# Altium project lpedt_project_board_cubit.PrjPcb (part 1 of 4)
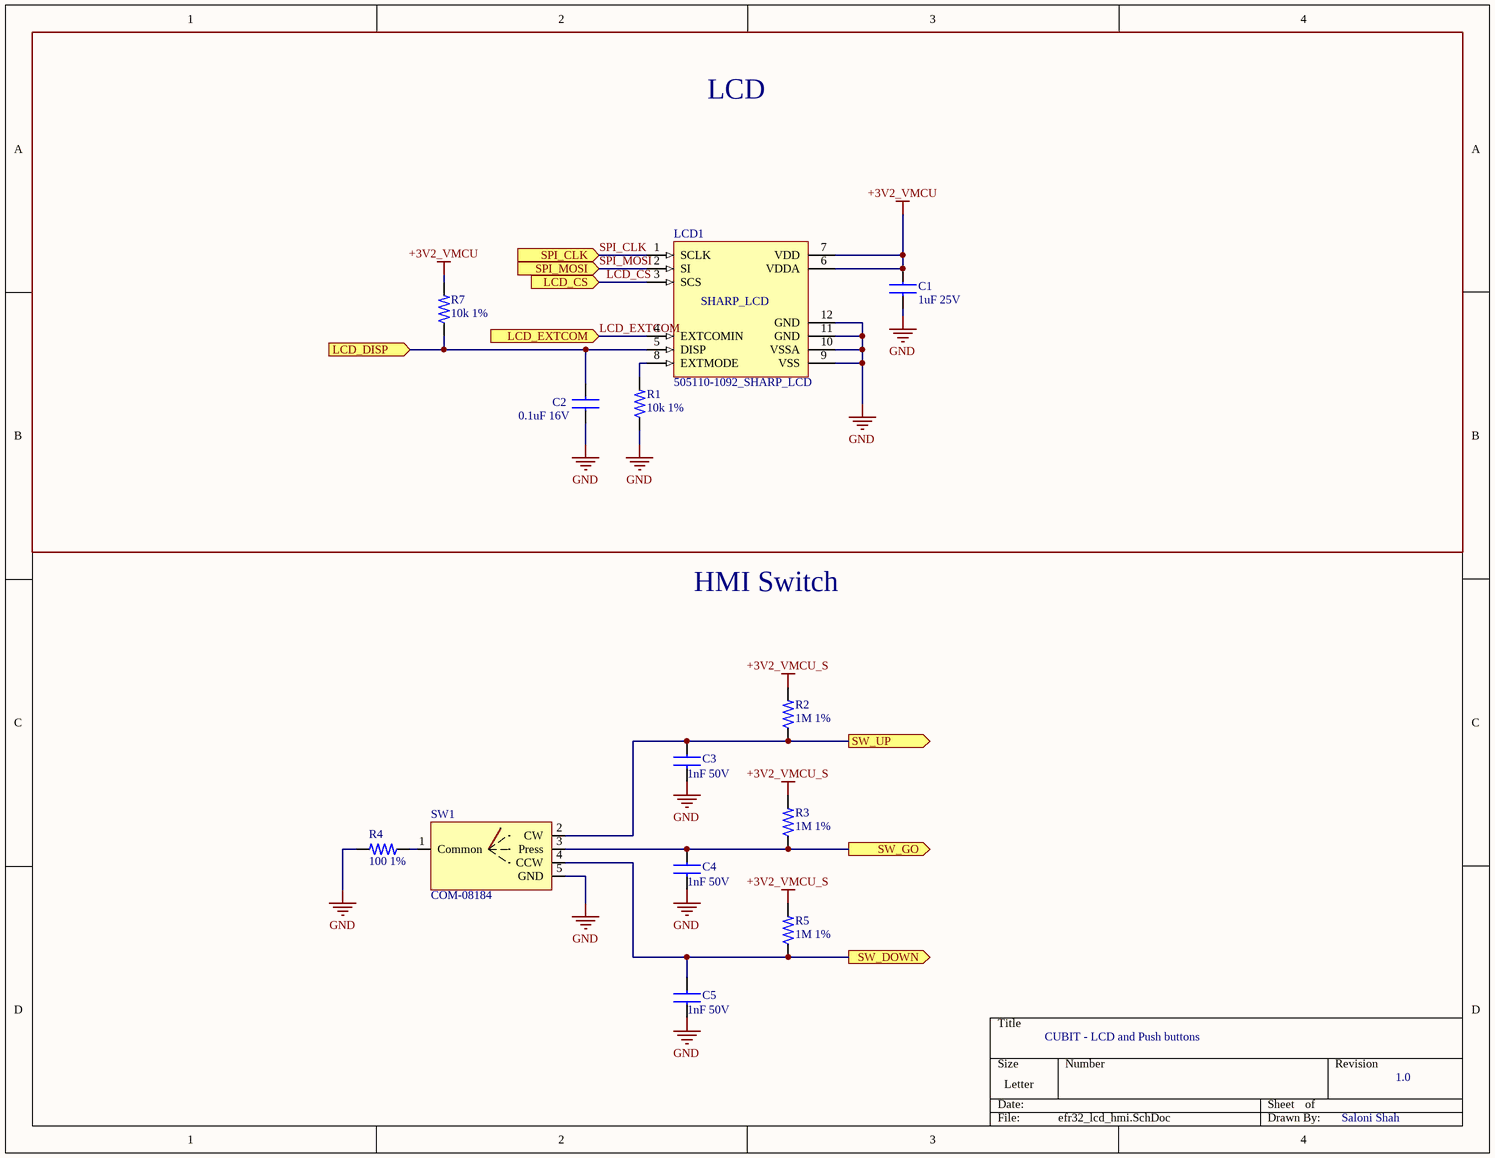
[diagram p0: efr32_lcd_hmi.SchDoc]
7 sheets, 147 parts. Net scope: flat (ports and power ports of the same name join across sheets).
Board files: Cubit3_main_pcb.PcbDoc, Cubit3_solar_panel.PcbDoc
Sheets:
  efr32_lcd_hmi.SchDoc
  efr32_ioport.SchDoc
  efr32_radio_interface.SchDoc
  power_management.SchDoc
  ultrasonic_imu_sensor.SchDoc
  Mag_Enc_Sensors_muxed.SchDoc
  solar_cell.SchDoc

## Sheet efr32_lcd_hmi.SchDoc
size Letter; SheetNumber: 2; SheetTotal: 8

### Parts
C1  1uF 25V  [CAP_0805_02X125]
C2  0.1uF 16V  [CAP_0603_1MM]
C3  1nF 50V  [CAP_0805_02X125]
C4  1nF 50V  [CAP_0805_02X125]
C5  1nF 50V  [CAP_0805_02X125]
LCD1  505110-1092_SHARP_LCD  [SHARP_LCD]
R1  10k 1%  [2_Chip_0603_RMCF]
R2  1M 1%  [2_Chip_0603_RMCF]
R3  1M 1%  [2_Chip_0603_RMCF]
R4  100 1%  [2_Chip_0603_RMCF]
R5  1M 1%  [2_Chip_0603_RMCF]
R7  10k 1%  [2_Chip_0603_RMCF]
SW1  COM-08184  [Navigation_switch]

### Blocks framed on the sheet
LCD: C1 C2 LCD1 R1 R7

### Ports
LCD_CS (in), LCD_DISP (in), LCD_EXTCOM (in), SPI_CLK (in), SPI_MOSI (in), SW_DOWN (out), SW_GO (out), SW_UP (out)

### Nets
+3V2_VMCU: C1.1 LCD1.6(VDDA) LCD1.7(VDD) R7.2
+3V2_VMCU_S: R2.2 R3.2 R5.2
GND: C1.2 C2.2 C3.2 C4.2 C5.2 LCD1.9(VSS) LCD1.10(VSSA) LCD1.11(GND) LCD1.12(GND) R1.1 R4.2 SW1.5(GND)
LCD_CS: LCD1.3(SCS) ; port LCD_CS
LCD_DISP: C2.1 LCD1.5(DISP) R7.1 ; port LCD_DISP
LCD_EXTCOM: LCD1.4(EXTCOMIN) ; port LCD_EXTCOM
SPI_CLK: LCD1.1(SCLK) ; port SPI_CLK
SPI_MOSI: LCD1.2(SI) ; port SPI_MOSI
SW_DOWN: C5.1 R5.1 SW1.4(CCW) ; port SW_DOWN
SW_GO: C4.1 R3.1 SW1.3(Press) ; port SW_GO
SW_UP: C3.1 R2.1 SW1.2(CW) ; port SW_UP
NetLCD1_8: LCD1.8(EXTMODE) R1.2
NetR4_1: R4.1 SW1.1(Common)

### Notes on the sheet
- HMI Switch
- CUBIT - LCD and Push buttons
- 1.0
- Saloni Shah
- (in symbol 505110-1092_SHARP_LCD) SHARP_LCD

### Library data of the parts
C1 = GRM216R61E105KA12D: Cap 1 µF ±10% 25V Ceramic Capacitor X5R 0805 (2012 Metric); Manufacturer: Murata; Supplier 1: Digi-Key; Manufacturer Part Number: GRM216R61E105KA12D; RoHS: Yes; Category: Ceramic Capacitors; Stock 1: 738438; Pricing 1: 4000=0.09051, 8000=0.08518, 12000=0.08252, 28000=0.07986, 100000=0.06921 (USD); Mount: Surface Mount; Case/Package: 0805; Number of Pins: 2; Case Code (Imperial): 0805; Case Code (Metric): 2012; Material: Ceramic; Min Operating Temperature: -55°C; Max Operating Temperature: 85°C; Package Quantity: 1; Series: GRM; Packaging: Tape and Reel; Capacitance: 1uF; Voltage Rating: 25V; Voltage Rating (DC): 25V; Tolerance: 10%; Dielectric: X5R; Termination: SMD/SMT; Voltage: 25V; Construction: Flat; Length: 2mm; Width: 1.25mm; Height: 0.6mm; Thickness: 0.028inch; Depth: 1.25mm; Radiation Hardening: No; Lead Free: Lead Free; REACH SVHC: No SVHC; RoHS Compliant: Yes; ComponentLink1URL: https://datasheet.ciiva.com/11787/0900766b80ef921d-11787891.pdf?src-supplier=RSComponents; ComponentLink1Description: https://datasheet.ciiva.com/11787/0900766b80ef921d-11787891.pdf?src-supplier=RSComponents; ComponentLink2URL: https://datasheet.ciiva.com/5424/product-5424880.pdf?src-supplier=Mouser; ComponentLink2Description: https://datasheet.ciiva.com/5424/product-5424880.pdf?src-supplier=Mouser; ComponentLink3URL: https://datasheet.ciiva.com/3777/337grm216r61e105ka1223-3777289.pdf?src-supplier=Arrow+Electronics; ComponentLink3Description: https://datasheet.ciiva.com/3777/337grm216r61e105ka1223-3777289.pdf?src-supplier=Arrow+Electronics; ComponentLink4URL: https://datasheet.ciiva.com/7719/c02e-7719049.pdf?src-supplier=Element14; ComponentLink4Description: https://datasheet.ciiva.com/7719/c02e-7719049.pdf?src-supplier=Element14; ComponentLink5URL: https://datasheet.ciiva.com/22706/1889704-22706791.pdf?src-supplier=Element14; ComponentLink5Description: https://datasheet.ciiva.com/22706/1889704-22706791.pdf?src-supplier=Element14; ComponentLink6URL: https://datasheet.ciiva.com/138/partnumbering-e-01-138518.pdf?src-supplier=Digi-Key; ComponentLink6Description: https://datasheet.ciiva.com/138/partnumbering-e-01-138518.pdf?src-supplier=Digi-Key; ComponentLink7URL: https://datasheet.ciiva.com/138/partnumbering-e-01-138517.pdf?src-supplier=Digi-Key; ComponentLink7Description: https://datasheet.ciiva.com/138/partnumbering-e-01-138517.pdf?src-supplier=Digi-Key; ComponentLink8URL: https://datasheet.ciiva.com/138/partnumbering-e-01-138519.pdf?src-supplier=Digi-Key; ComponentLink8Description: https://datasheet.ciiva.com/138/partnumbering-e-01-138519.pdf?src-supplier=Digi-Key; ComponentLink9URL: https://datasheet.ciiva.com/2989/product-2989638.pdf?src-supplier=Avnet; ComponentLink9Description: https://datasheet.ciiva.com/2989/product-2989638.pdf?src-supplier=Avnet
C2 = C0805C104K4RACAUTO: Cap Ceramic 0.1uF 16V X7R 10% SMD 0603 125°C Paper T/R; Manufacturer: KEMET; Capacitance: 100nF; Supplier 1: Digi-Key; Manufacturer Part Number: C0805C104K4RACAUTO; RoHS: Yes; Category: Ceramic Capacitors; Stock 1: 15900; Pricing 1: 1=0.24000, 10=0.16200, 50=0.09700, 100=0.08190, 500=0.05606, 1000=0.04959 (USD); Case/Package: 0805; Min Operating Temperature: -55°C; Max Operating Temperature: 125°C; Tolerance: 10%; Packaging: Tape and Reel; Dielectric: X7R; Length: 2mm; Depth: 1.25mm; RoHS Compliant: Yes; ComponentLink1URL: http://components.arrow.com/part/dataview/0323_00325188?src-supplier=Arrow+Europe; ComponentLink1Description: http://components.arrow.com/part/dataview/0323_00325188?src-supplier=Arrow+Europe
C3-C5 = CL21B102KBANFNC: 1nF ±10% 50V X7R 0805; Manufacturer: Samsung; Supplier 1: Digi-Key; Manufacturer Part Number: CL21B102KBANFNC; RoHS: Yes; Category: Ceramic Capacitors; Stock 1: 1056; Pricing 1: 1=0.10000, 10=0.04300, 50=0.02360, 100=0.01940, 500=0.01382, 1000=0.01086 (USD); Mount: Surface Mount; Case/Package: 0805; Case Code (Metric): 2012; Case Code (Imperial): 0805; Contact Plating: Tin; Min Operating Temperature: -55°C; Max Operating Temperature: 125°C; Capacitance: 1nF; Tolerance: 10%; Package Quantity: 1; Packaging: Tape and Reel; Voltage Rating: 50V; Dielectric: X7R; Series: CL; Construction: Flat; Length: 0.079inch; Width: 0.049inch; Height: 0.65mm; Thickness: 0.03inch; Depth: 1.25mm; Radiation Hardening: No; RoHS Compliant: Yes; ComponentLink1URL: https://datasheet.ciiva.com/25780/cl21b102kbanfnc-25780808.pdf?src-supplier=Digi-Key; ComponentLink1Description: https://datasheet.ciiva.com/25780/cl21b102kbanfnc-25780808.pdf?src-supplier=Digi-Key
LCD1 = 505110-1092_SHARP_LCD: FFC/FPC Connector, 10 Contact(s), 1 Row(s), Female, Right Angle, Surface Mount Terminal; Manufacturer: Molex; Connector Type: CARD EDGE CONNECTOR; Option: General Purpose; Filter Feature: No; Number of Rows Loaded: 1; Number of Contacts: 10; Supplier 1: Digi-Key; Manufacturer Part Number: 505110-1092; RoHS: Yes; Category: FFC / FPC; Stock 1: 86494; Pricing 1: 1=0.77, 10=0.653, 100=0.5078, 1000=0.39896 (USD); Mount: Board; Contact Material: Bronze; Contact Finish - Mating: GOLD OVER NICKEL; Contact Finish - Termination: GOLD OVER NICKEL; JESD-609 Code: e4; Contact Gender: Female; Mating Information: NO; Mixed Contacts: No; Mounting Style: RIGHT ANGLE; Termination: SMD/SMT; Terminal Pitch: 0.5mm; Flammability Rating: UL94 V-0; DIN Conformance: No; IEC Conformance: No; MIL Conformance: No; Reach SVHC Compliant: Yes; RoHS Compliant: Yes; ComponentLink1URL: https://datasheet.ciiva.com:443/pdfs/VipMasterIC/IC/MOLE/MOLE-S-A0009009131/MOLE-S-A0009009131-1.pdf?src-supplier=IHS+Markit; ComponentLink1Description: https://datasheet.ciiva.com:443/pdfs/VipMasterIC/IC/MOLE/MOLE-S-A0009009131/MOLE-S-A0009009131-1.pdf?src-supplier=IHS+Markit; ComponentLink2URL: https://media.digikey.com/pdf/Data%20Sheets/Molex%20PDFs/FFC-FPC_Connectors.pdf?src-supplier=Digi-Key; ComponentLink2Description: https://media.digikey.com/pdf/Data%20Sheets/Molex%20PDFs/FFC-FPC_Connectors.pdf?src-supplier=Digi-Key; ComponentLink3URL: http://www.farnell.com/datasheets/2215713.pdf?src-supplier=Farnell; ComponentLink3Description: http://www.farnell.com/datasheets/2215713.pdf?src-supplier=Farnell; ComponentLink4URL: https://www.mouser.com/ds/2/276/5051101092_FFC_FPC_CONNECTORS-772849.pdf?src-supplier=Mouser; ComponentLink4Description: https://www.mouser.com/ds/2/276/5051101092_FFC_FPC_CONNECTORS-772849.pdf?src-supplier=Mouser; ComponentLink5URL: http://www.alliedelec.com/m/d/498d8ef60ec1840486550b3bb04c7a47.pdf?src-supplier=Allied+Electronics; ComponentLink5Description: http://www.alliedelec.com/m/d/498d8ef60ec1840486550b3bb04c7a47.pdf?src-supplier=Allied+Electronics; ComponentLink6URL: https://www.molex.com/datasheets/rohspdf/5051101092_rohs.pdf?src-supplier=Digi-Key; ComponentLink6Description: https://www.molex.com/datasheets/rohspdf/5051101092_rohs.pdf?src-supplier=Digi-Key; ComponentLink7URL: http://www.farnell.com/datasheets/2215713.pdf?src-supplier=Newark; ComponentLink7Description: http://www.farnell.com/datasheets/2215713.pdf?src-supplier=Newark; ComponentLink8URL: http://www.farnell.com/datasheets/2014276.pdf?src-supplier=Element14; ComponentLink8Description: http://www.farnell.com/datasheets/2014276.pdf?src-supplier=Element14; ComponentLink9URL: http://www.farnell.com/datasheets/2215713.pdf?src-supplier=Element14; ComponentLink9Description: http://www.farnell.com/datasheets/2215713.pdf?src-supplier=Element14
R1 R7 = RMCF0603FT10K0: Res 10K Ohm 1% 1/10W ±100ppm/°C Molded SMD SMD Paper T/R; Manufacturer: Stackpole Electronics; Resistance: 10kR; Power Rating: 100mW; Supplier 1: Digi-Key; Manufacturer Part Number: RMCF0603FT10K0; RoHS: Yes; Category: Chip SMD Resistors; Stock 1: 15114443; Pricing 1: 5000=0.00218 (USD); Mount: Surface Mount; Case/Package: 0603; Case Code (Metric): 1608; Case Code (Imperial): 0603; Contact Plating: Tin,Matte; Size Code: 0603; Min Operating Temperature: -55°C; Max Operating Temperature: 155°C; Tolerance: 1%; Packaging: Tape and Reel; Resistor Type: Thick Film; Number of Terminations: 2; Max Power Dissipation: 100mW; Temperature Coefficient: 100ppm/°C; Features: Automotive AEC-Q200; Series: RMCF; Construction: Rectangular; Length: 1.55mm; Width: 0.031inch; Height: 0.022inch; Depth: 0.8mm; Radiation Hardening: No; Military Standard: Not; Lead Free: Lead Free; RoHS Compliant: Yes; ComponentLink1URL: http://components.arrow.com/part/dataview/43747082S6756917N1174?src-supplier=Arrow+Electronics; ComponentLink1Description: http://components.arrow.com/part/dataview/43747082S6756917N1174?src-supplier=Arrow+Electronics; ComponentLink2URL: https://www.seielect.com/catalog/SEI-RMCF_RMCP.pdf?src-supplier=Avnet; ComponentLink2Description: https://www.seielect.com/catalog/SEI-RMCF_RMCP.pdf?src-supplier=Avnet; ComponentLink3URL: http://www.seielect.com/catalog/sei-rmc.pdf?src-supplier=Future+Electronics; ComponentLink3Description: http://www.seielect.com/catalog/sei-rmc.pdf?src-supplier=Future+Electronics; ComponentLink4URL: https://www.verical.com/server-webapp/html/getDatasheet?partID=360913&src-supplier=Verical; ComponentLink4Description: https://www.verical.com/server-webapp/html/getDatasheet?partID=360913&src-supplier=Verical; ComponentLink5URL: https://www.seielect.com/catalog/sei-rmcf_rmcp.pdf?src-supplier=Digi-Key; ComponentLink5Description: https://www.seielect.com/catalog/sei-rmcf_rmcp.pdf?src-supplier=Digi-Key
R2 R3 R5 = RMCF0603FT1M00: Res 1M Ohm 1% 1/10W ±100ppm/°C Molded SMD Paper T/R; Manufacturer: Stackpole Electronics; Resistance: 1MR; Power Rating: 100mW; Working Voltage: 75V; Supplier 1: Digi-Key; Manufacturer Part Number: RMCF0603FT1M00; RoHS: Yes; Category: Chip SMD Resistors; Stock 1: 2136203; Pricing 1: 1=0.10000, 10=0.01700, 100=0.00680, 1000=0.00305, 2500=0.00264 (USD); Mount: Surface Mount; Case/Package: 0603; Case Code (Metric): 1608; Case Code (Imperial): 0603; Contact Plating: Tin,Matte; Min Operating Temperature: -55°C; Max Operating Temperature: 155°C; Tolerance: 1%; Packaging: Tape and Reel; Resistor Type: Thick Film; Number of Terminations: 2; Max Power Dissipation: 100mW; Temperature Coefficient: 100ppm/°C; Features: Automotive AEC-Q200; Series: RMCF; Construction: Rectangular; Technology: THICK FILM; Length: 1.55mm; Width: 0.031inch; Height: 0.022inch; Depth: 0.8mm; Radiation Hardening: No; Military Standard: Not; Lead Free: Lead Free; RoHS Compliant: Yes; ComponentLink1URL: https://datasheet.ciiva.com/15193/getdatasheetpartid-363151-15193451.pdf?src-supplier=Verical; ComponentLink1Description: https://datasheet.ciiva.com/15193/getdatasheetpartid-363151-15193451.pdf?src-supplier=Verical
R4 = RMCF0603FT100R: Res 100 Ohm 1% 1/10W ±100ppm/°C Molded SMD SMD Paper T/R; Manufacturer: Stackpole Electronics; Resistance: 100R; Power Rating: 100mW; Supplier 1: Digi-Key; Manufacturer Part Number: RMCF0603FT100R; RoHS: Yes; Category: Chip SMD Resistors; Pricing 1: 1=0.10000, 10=0.01700, 100=0.00680, 1000=0.00305, 2500=0.00264 (USD); Mount: Surface Mount; Case/Package: 0603; Case Code (Metric): 1608; Case Code (Imperial): 0603; Contact Plating: Tin,Matte; Size Code: 0603; Min Operating Temperature: -55°C; Max Operating Temperature: 155°C; Tolerance: 1%; Packaging: Tape and Reel; Resistor Type: Thick Film; Number of Terminations: 2; Max Power Dissipation: 100mW; Temperature Coefficient: 100ppm/°C; Features: Automotive AEC-Q200; Series: RMCF; Construction: Rectangular; Length: 1.55mm; Width: 0.031inch; Height: 0.022inch; Depth: 0.8mm; Radiation Hardening: No; Military Standard: Not; Lead Free: Lead Free; RoHS Compliant: Yes; ComponentLink1URL: https://datasheet.ciiva.com/15215/getdatasheetpartid-360413-15215981.pdf?src-supplier=Verical; ComponentLink1Description: https://datasheet.ciiva.com/15215/getdatasheetpartid-360413-15215981.pdf?src-supplier=Verical
SW1 = COM-08184: Surface Mount Navigation Switch; Manufacturer: SparkFun; Supplier 1: Digikey; Manufacturer Part Number: COM-08184; RoHS: No; Stock 1: 109; Pricing 1: 1=1.6 (USD); ComponentLink1URL: https://cdn.sparkfun.com/datasheets/Components/Switches/LEVER8184.pdf?src-supplier=Digikey; ComponentLink1Description: https://cdn.sparkfun.com/datasheets/Components/Switches/LEVER8184.pdf?src-supplier=Digikey

## Sheet efr32_ioport.SchDoc
size A; SheetNumber: 3; SheetTotal: 8
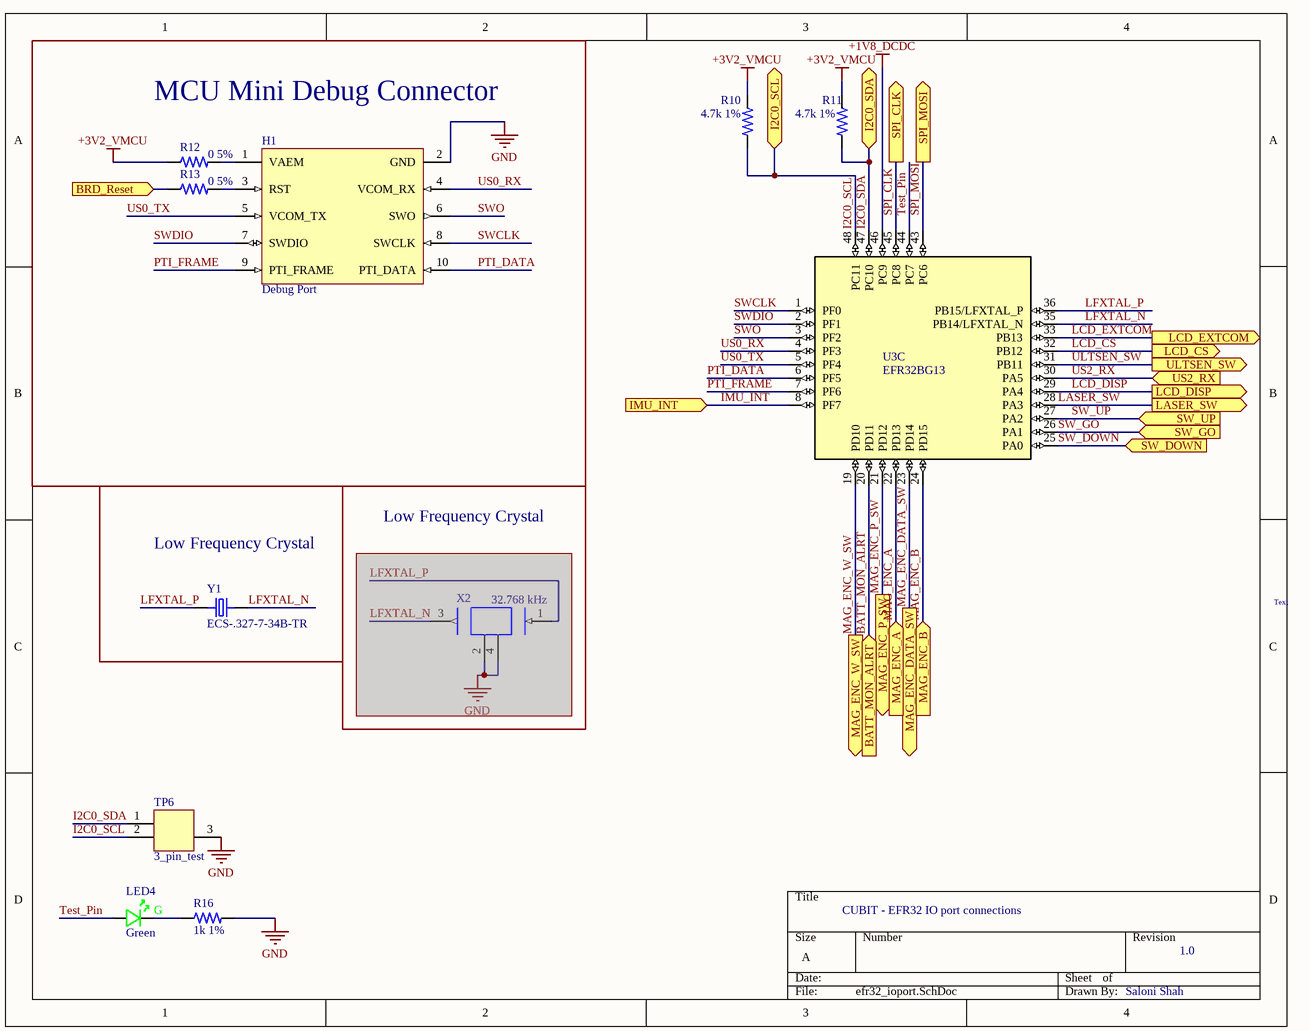
[diagram p1: efr32_ioport.SchDoc]

### Parts
H1  Debug Port  [Amphenol_20021121_0]
LED4  Green  [LED_0603_RED_WL-SMCW]
R10  4.7k 1%  [CAP_0603_1MM]
R11  4.7k 1%  [CAP_0603_1MM]
R12  0 5%  [CAP_0402_1mm]
R13  0 5%  [CAP_0402_1mm]
R16  1k 1%  [2_Chip_0603_RMCF]
TP6  3_pin_test  [3_PIN_100mil]
U3  EFR32BG13  [48-QFN_7x7]  (part C of 3)
X2  32.768 kHz  [OSC_ASDDV-48.000MHZ-LC-T]  (masked out: inside a compile mask, not in the netlist)
Y1  ECS-.327-7-34B-TR  [XTAL_ECS-.327-7-34B-TR]

### Blocks framed on the sheet
MCU Mini Debug Connector: H1 R12 R13
Low Frequency Crystal: Y1
Low Frequency Crystal: X2

### Ports
BATT_MON_ALRT (in), BRD_Reset (in), I2C0_SCL (bidir), I2C0_SDA (bidir), IMU_INT (in), LASER_SW (out), LCD_CS (out), LCD_DISP (out), LCD_EXTCOM (out), MAG_ENC_A (in), MAG_ENC_B (in), MAG_ENC_DATA_SW (out), MAG_ENC_P_SW (out), MAG_ENC_W_SW (out), SPI_CLK (out), SPI_MOSI (out), SW_DOWN (in), SW_GO (in), SW_UP (in), ULTSEN_SW (out), US2_RX (in)

### Nets
+1V8_DCDC: U3.46(PC9)
+3V2_VMCU: R10.1 R11.1 R12.1
GND: H1.2(GND) R16.2 TP6.3
BATT_MON_ALRT: U3.20(PD11) ; port BATT_MON_ALRT
BRD_Reset: R13.1 ; port BRD_Reset
I2C0_SCL: R10.2 TP6.2 U3.48(PC11) ; port I2C0_SCL
I2C0_SDA: R11.2 TP6.1 U3.47(PC10) ; port I2C0_SDA
IMU_INT: U3.8(PF7) ; port IMU_INT
LASER_SW: U3.28(PA3) ; port LASER_SW
LCD_CS: U3.32(PB12) ; port LCD_CS
LCD_DISP: U3.29(PA4) ; port LCD_DISP
LCD_EXTCOM: U3.33(PB13) ; port LCD_EXTCOM
LFXTAL_N: U3.35(PB14/LFXTAL_N) Y1.2
LFXTAL_P: U3.36(PB15/LFXTAL_P) Y1.1
MAG_ENC_A: U3.22(PD13) ; port MAG_ENC_A
MAG_ENC_B: U3.24(PD15) ; port MAG_ENC_B
MAG_ENC_DATA_SW: U3.23(PD14) ; port MAG_ENC_DATA_SW
MAG_ENC_P_SW: U3.21(PD12) ; port MAG_ENC_P_SW
MAG_ENC_W_SW: U3.19(PD10) ; port MAG_ENC_W_SW
PTI_DATA: H1.10(PTI_DATA) U3.6(PF5)
PTI_FRAME: H1.9(PTI_FRAME) U3.7(PF6)
SPI_CLK: U3.45(PC8) ; port SPI_CLK
SPI_MOSI: U3.43(PC6) ; port SPI_MOSI
SW_DOWN: U3.25(PA0) ; port SW_DOWN
SW_GO: U3.26(PA1) ; port SW_GO
SW_UP: U3.27(PA2) ; port SW_UP
SWCLK: H1.8(SWCLK) U3.1(PF0)
SWDIO: H1.7(SWDIO) U3.2(PF1)
SWO: H1.6(SWO) U3.3(PF2)
Test_Pin: LED4.A U3.44(PC7)
ULTSEN_SW: U3.31(PB11) ; port ULTSEN_SW
US0_RX: H1.4(VCOM_RX) U3.4(PF3)
US0_TX: H1.5(VCOM_TX) U3.5(PF4)
US2_RX: U3.30(PA5) ; port US2_RX
NetH1_1: H1.1(VAEM) R12.2
NetH1_3: H1.3(RST) R13.2
NetLED4_C: LED4.C R16.1

### Notes on the sheet
- Text
- CUBIT - EFR32 IO port connections
- 1.0
- Saloni Shah
- (in symbol QBLP601-AG1) G

### Library data of the parts
H1 = 20021121-00010C1LF: CONN HEADER SMD 10POS 1.27MM. Connector Header Surface Mount 10 position 0.050"; Manufacturer: Amphenol ICC / FCI; Supplier 1: Digi-Key; Manufacturer Part Number: 20021121-00010C1LF; RoHS: No; Category: Headers and Wire Housings
LED4 = QBLP601-AG1: Led Green Clear 0603 SMD; Manufacturer: QT-Brightek; Supplier 1: Digi-Key; Manufacturer Part Number: QBLP601-AG1; RoHS: No; Stock 1: 5990; Pricing 1: 1=0.35000, 10=0.19000, 100=0.08820, 500=0.08140, 1000=0.06377, 2000=0.06242 (USD)
R10 R11 = AF0603FR-074K7L: Res Thick Film 0603 4.7K Ohm 1% 1/10W ±100ppm/°C Molded SMD Paper T/R; Manufacturer: Yageo; Resistance: 4.7kR; Power Rating: 100mW; Voltage Rating: 75V; Supplier 1: Digi-Key; Manufacturer Part Number: AF0603FR-074K7L; RoHS: Yes; Category: Chip SMD Resistors; Stock 1: 6660; Pricing 1: 1=0.10000, 10=0.06100, 100=0.02470, 1000=0.01109, 2500=0.00963 (USD); Case/Package: 0603; Case Code (Imperial): 0603; Case Code (Metric): 1608; Weight: 7.1E-05oz; Min Operating Temperature: -55°C; Max Operating Temperature: 155°C; Tolerance: 1%; Packaging: Tape and Reel; Resistor Type: Thick Film; Number of Terminations: 2; Package Quantity: 5000; Termination: SMD/SMT; Max Power Dissipation: 100mW; Temperature Coefficient: 100ppm/°C; Features: Moisture Resistant,Anti-Sulfur; Length: 0.063inch; Width: 0.031inch; Height: 0.022inch; RoHS Compliant: Yes; ComponentLink1URL: http://www.mouser.com/ds/2/447/PYu-AF_51_RoHS_L_5-1085711.pdf?src-supplier=Mouser; ComponentLink1Description: http://www.mouser.com/ds/2/447/PYu-AF_51_RoHS_L_5-1085711.pdf?src-supplier=Mouser; ComponentLink2URL: http://www.yageo.com/documents/recent/PYu-AF_51_RoHS_L_5.pdf?src-supplier=Digi-Key; ComponentLink2Description: http://www.yageo.com/documents/recent/PYu-AF_51_RoHS_L_5.pdf?src-supplier=Digi-Key
R12 R13 = RC1005J000CS: Res 0 Ohms ±5% 0.063 W 0402 Thick Film Surface Mount Chip Resistor; Manufacturer: Samsung; Resistance: 0R; Power Rating: 63mW; Temperature Coefficient: 200ppm/°C; Voltage Rating (DC): 50V; Supplier 1: Digi-Key; Manufacturer Part Number: RC1005J000CS; RoHS: Yes; Category: Chip SMD Resistors; Stock 1: 580; Pricing 1: 1=0.10000, 10=0.04200, 25=0.03040, 50=0.02300, 100=0.01700, 250=0.01296, 500=0.01036, 1000=0.00763, 5000=0.00547 (USD); Mount: Surface Mount; Case/Package: 0402; Case Code (Metric): 1005; Case Code (Imperial): 0402; Contact Plating: Tin; Size Code: 0402; Min Operating Temperature: -55°C; Max Operating Temperature: 125°C; Packaging: Tape and Reel; Tolerance: 5%; Resistor Type: Thick Film; Number of Terminations: 2; Max Power Dissipation: 63mW; Features: Moisture Resistant; Series: RC; Construction: Rectangular; Length: 1mm; Width: 0.02inch; Height: 0.016inch; Depth: 0.5mm; Radiation Hardening: No; Military Standard: Not; Lead Free: Lead Free; RoHS Compliant: Yes; ComponentLink1URL: https://datasheet.ciiva.com/15196/getdatasheetpartid-499011-15196236.pdf?src-supplier=Verical; ComponentLink1Description: https://datasheet.ciiva.com/15196/getdatasheetpartid-499011-15196236.pdf?src-supplier=Verical; ComponentLink2URL: https://datasheet.ciiva.com/16449/rcseries-16449310.pdf?src-supplier=Future+Electronics; ComponentLink2Description: https://datasheet.ciiva.com/16449/rcseries-16449310.pdf?src-supplier=Future+Electronics
R16 = RMCF0603FT1K00: Res 1K Ohm 1% 0.1W(1/10W) ±100ppm/C Pad SMD Automotive T/R; Manufacturer: Stackpole Electronics; Resistance: 1kR; Power Rating: 100mW; Temperature Coefficient: 100ppm/°C; Supplier 1: Digi-Key; Manufacturer Part Number: RMCF0603FT1K00; RoHS: Yes; Category: Chip SMD Resistors; Pricing 1: 1=0.10000, 10=0.01700, 100=0.00680, 1000=0.00305, 2500=0.00264 (USD); Mount: Surface Mount; Case/Package: 0603; Case Code (Metric): 1608; Case Code (Imperial): 0603; Contact Plating: Tin,Matte; Size Code: 0603; Min Operating Temperature: -55°C; Max Operating Temperature: 155°C; Tolerance: 1%; Packaging: Tape and Reel; Resistor Type: Thick Film; Number of Terminations: 2; Max Power Dissipation: 100mW; Features: Automotive AEC-Q200; Series: RMCF; Construction: Rectangular; Length: 1.55mm; Width: 0.031inch; Height: 0.022inch; Depth: 0.8mm; Radiation Hardening: No; Military Standard: Not; Lead Free: Lead Free; RoHS Compliant: Yes; ComponentLink1URL: https://www.seielect.com/catalog/sei-rmcf_rmcp.pdf?src-supplier=Digi-Key; ComponentLink1Description: https://www.seielect.com/catalog/sei-rmcf_rmcp.pdf?src-supplier=Digi-Key; ComponentLink2URL: https://www.seielect.com/catalog/SEI-RMCF_RMCP.pdf?src-supplier=Avnet; ComponentLink2Description: https://www.seielect.com/catalog/SEI-RMCF_RMCP.pdf?src-supplier=Avnet; ComponentLink3URL: https://www.seielect.com/catalog/SEI-Packaging.pdf?src-supplier=Avnet; ComponentLink3Description: https://www.seielect.com/catalog/SEI-Packaging.pdf?src-supplier=Avnet; ComponentLink4URL: https://www.seielect.com/catalog/SEI-Packaging.pdf?src-supplier=Arrow+Electronics; ComponentLink4Description: https://www.seielect.com/catalog/SEI-Packaging.pdf?src-supplier=Arrow+Electronics; ComponentLink5URL: https://www.seielect.com/catalog/SEI-RMCF_RMCP.pdf?src-supplier=Avnet+Asia; ComponentLink5Description: https://www.seielect.com/catalog/SEI-RMCF_RMCP.pdf?src-supplier=Avnet+Asia; ComponentLink6URL: http://www.seielect.com/Catalog/SEI-rmc.pdf?src-supplier=Future+Electronics; ComponentLink6Description: http://www.seielect.com/Catalog/SEI-rmc.pdf?src-supplier=Future+Electronics; ComponentLink7URL: https://www.seielect.com/catalog/SEI-Packaging.pdf?src-supplier=Verical; ComponentLink7Description: https://www.seielect.com/catalog/SEI-Packaging.pdf?src-supplier=Verical; ComponentLink8URL: https://www.seielect.com/catalog/SEI-Packaging.pdf?src-supplier=Quest; ComponentLink8Description: https://www.seielect.com/catalog/SEI-Packaging.pdf?src-supplier=Quest
U3 = EFR32BG13P732F512GM48-D: Blue Gecko QFN48 2.4 G 19 dB BLE/Proprietary 512 kB 64 kB(RAM) 31GPIO; Manufacturer: Silicon Labs; Supplier 1: Digi-Key; Manufacturer Part Number: EFR32BG13P732F512GM48-D; RoHS: Yes; Category: RF Receivers, Transceivers; Pricing 1: 1=8.42000, 10=7.72000, 25=7.01800, 80=6.31625, 230=5.78987, 440=5.26350, 945=4.78499 (USD); ComponentLink1URL: http://www.farnell.com/datasheets/2813683.pdf?src-supplier=Farnell; ComponentLink1Description: http://www.farnell.com/datasheets/2813683.pdf?src-supplier=Farnell
X2 = ASDK2-32.768KHZ-LR-T3: Oscillator XO 0.032768MHz ±25ppm 15pF CMOS 60% 1.8V 4-Pin SMD T/R; Manufacturer: Abracon; Max Supply Current: 1.5mA; Supplier 1: Digi-Key; Manufacturer Part Number: ASDK2-32.768KHZ-LR-T3; RoHS: Yes; Category: Oscillators; Stock 1: 8544; Pricing 1: 1=0.97000, 10=0.86100, 50=0.80500, 100=0.71140, 500=0.67392, 1000=0.56160 (USD); Mount: Surface Mount; Case/Package: SMD/SMT; Min Operating Temperature: -40°C; Max Operating Temperature: 85°C; Packaging: Cut Tape; Frequency: 32.768kHz; Frequency Stability: 25ppm; Length: 0.098inch; Width: 0.079inch; Height: 0.037inch; ComponentLink1URL: http://www.farnell.com/datasheets/2581434.pdf?src-supplier=Farnell; ComponentLink1Description: http://www.farnell.com/datasheets/2581434.pdf?src-supplier=Farnell; ComponentLink2URL: https://abracon.com/Support/PackageDrawing/Oscillators/ASDK.PDF?src-supplier=Digi-Key; ComponentLink2Description: https://abracon.com/Support/PackageDrawing/Oscillators/ASDK.PDF?src-supplier=Digi-Key
Y1 = ECS-.327-7-34B-TR: 32.768kHz Â±20ppm Crystal 7pF 70 kOhms 2-SMD, No Lead; MF: ECS Inc.; Availability: Unavailable; MP: ECS-.327-7-34B-TR; Price: None; Value: *; SnapEDA_Link: https://www.snapeda.com/parts/ECS-.327-7-34B-TR/ECS%20Inc./view-part/55054/?ref=snap; Package: SMD-2 ECS International